# Altium project Bat_Detector_Full.PrjPcb
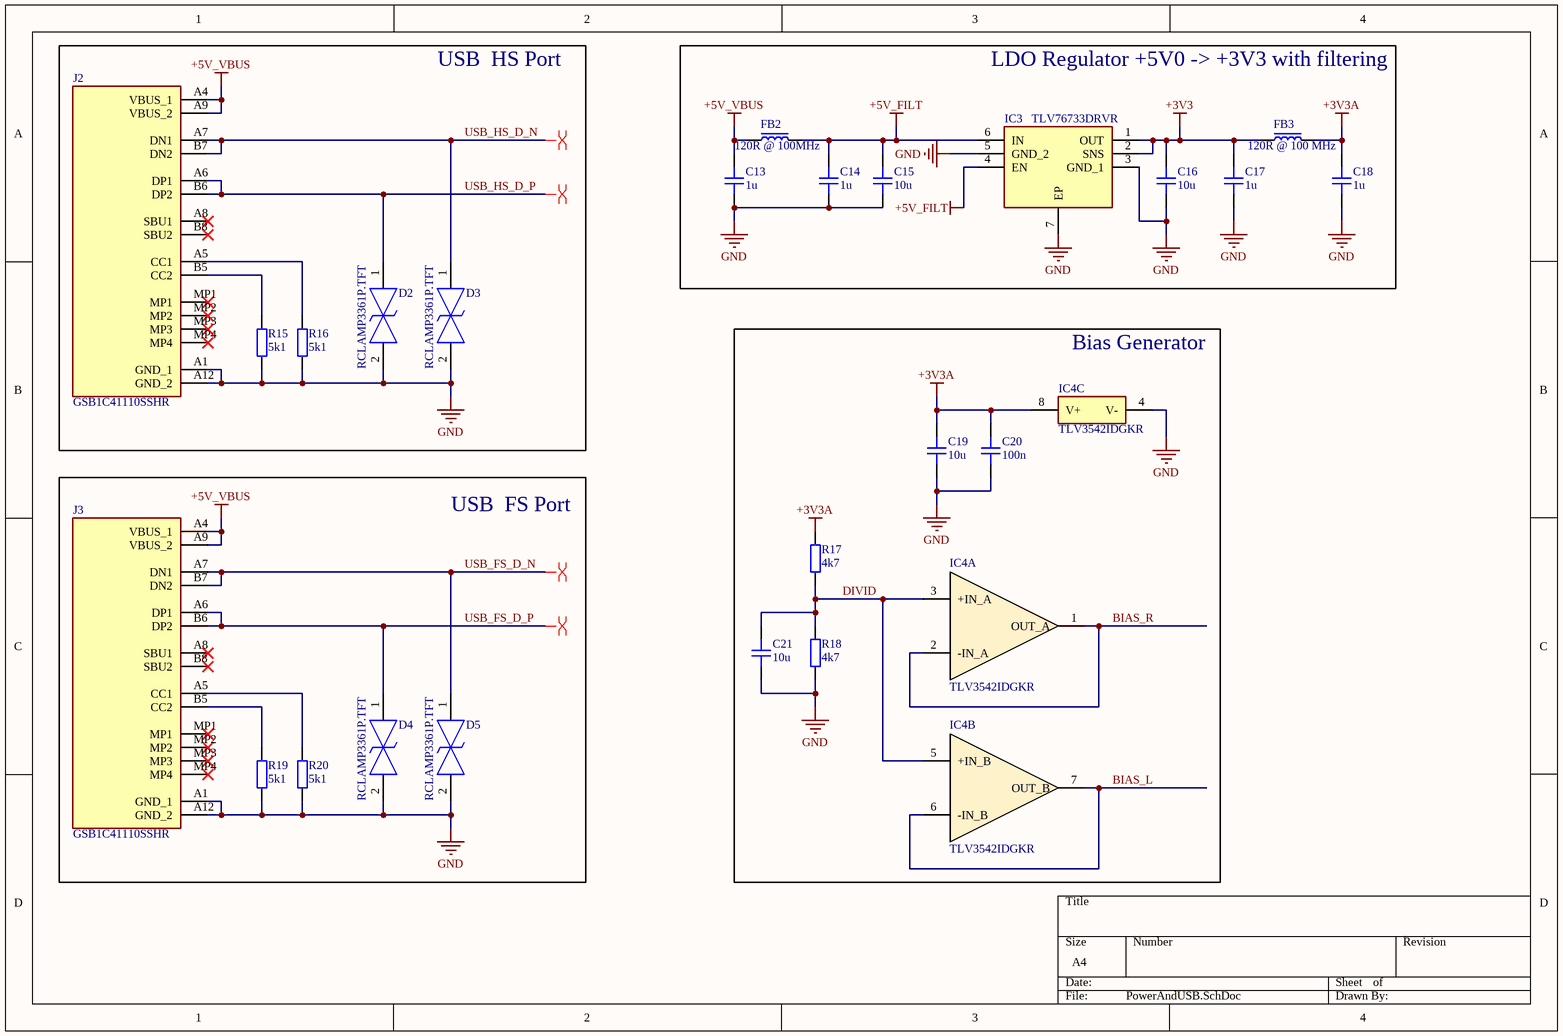
[diagram p0: PowerAndUSB.SchDoc]
4 sheets, 132 parts. Net scope: global (net labels, ports and power ports of the same name join across sheets).
Board file: PCBDesign.PcbDoc
Sheets:
  PowerAndUSB.SchDoc
  MCU.SchDoc
  AudioADC.SchDoc
  MEMSAndAnalogFrontend.SchDoc

## Sheet PowerAndUSB.SchDoc
size A4; SheetNumber: 1; SheetTotal: 4

### Parts
C13  1u  [CAP_0805]
C14  1u  [CAP_0805]
C15  10u  [CAP_0805]
C16  10u  [CAP_0805]
C17  1u  [CAP_0402]
C18  1u  [CAP_0402]
C19  10u  [CAP_0603]
C20  100n  [CAP_0402]
C21  10u  [CAP_0603]
D2  RCLAMP3361P.TFT  [RCLAMP3361PTFT]
D3  RCLAMP3361P.TFT  [RCLAMP3361PTFT]
D4  RCLAMP3361P.TFT  [RCLAMP3361PTFT]
D5  RCLAMP3361P.TFT  [RCLAMP3361PTFT]
FB2  120R @ 100MHz  [FB_0805]
FB3  120R @ 100 MHz  [FB_0603]
IC3  TLV76733DRVR  [SON65P200X200X80-7N]
IC4  TLV3542IDGKR  [SOP65P490X110-8N]  (parts A,B,C of 3)
J2  GSB1C41110SSHR  [GSB1C41110SSHR]
J3  GSB1C41110SSHR  [GSB1C41110SSHR]
R15  5k1  [RES_0402]
R16  5k1  [RES_0402]
R17  4k7  [RES_0603]
R18  4k7  [RES_0603]
R19  5k1  [RES_0402]
R20  5k1  [RES_0402]

### Blocks framed on the sheet
USB  HS Port: D2 D3 J2 R15 R16
LDO Regulator +5V0 -> +3V3 with filtering: C13-C18 FB2 FB3 IC3
Bias Generator: C19-C21 IC4 R17 R18
USB  FS Port: D4 D5 J3 R19 R20

### Nets
+3V3: C16.2 C17.1 FB3.1 IC3.1(OUT) IC3.2(SNS)
+3V3A: C18.1 C19.2 C20.2 FB3.2 IC4.8(V+) R17.2
+5V_FILT: C14.2 C15.2 FB2.2 IC3.4(EN) IC3.6(IN)
+5V_VBUS: C13.2 FB2.1 J2.A4(VBUS_1) J2.A9(VBUS_2) J3.A4(VBUS_1) J3.A9(VBUS_2)
GND: C13.1 C14.1 C15.1 C16.1 C17.2 C18.2 C19.1 C20.1 C21.1 D2.2 D3.2 D4.2 D5.2 IC3.3(GND_1) IC3.5(GND_2) IC3.7(EP) IC4.4(V-) J2.A1(GND_1) J2.A12(GND_2) J3.A1(GND_1) J3.A12(GND_2) R15.1 R16.1 R18.1 R19.1 R20.1
BIAS_L: IC4.6(-IN_B) IC4.7(OUT_B)
BIAS_R: IC4.1(OUT_A) IC4.2(-IN_A)
DIVID: C21.2 IC4.3(+IN_A) IC4.5(+IN_B) R17.1 R18.2
USB_FS_D_N: D5.1 J3.A7(DN1) J3.B7(DN2)
USB_FS_D_P: D4.1 J3.A6(DP1) J3.B6(DP2)
USB_HS_D_N: D3.1 J2.A7(DN1) J2.B7(DN2)
USB_HS_D_P: D2.1 J2.A6(DP1) J2.B6(DP2)
NetJ2_A5: J2.A5(CC1) R16.2
NetJ2_B5: J2.B5(CC2) R15.2
NetJ3_A5: J3.A5(CC1) R20.2
NetJ3_B5: J3.B5(CC2) R19.2

Not connected (* = marked no-connect by the designer): J2 A8(SBU1)* B8(SBU2)* MP1* MP2* MP3* MP4*; J3 A8(SBU1)* B8(SBU2)* MP1* MP2* MP3* MP4*

### Layout directives
differential pair: USB_FS_D_N, USB_FS_D_P, USB_HS_D_N, USB_HS_D_P

### Library data of the parts
C13-C16 = CAP_0805: Capacitor SMD 0805; Manufacturer: *; Manufacturer Part Number: *; Distributor Link: *; LCSC: *; Rating: *; Dielectric: *
C17 C18 C20 = CAP_0402: Capacitor SMD 0402; Manufacturer: *; Manufacturer Part Number: *; Distributor Link: *; LCSC: *; Rating: *; Dielectric: *
C19 C21 = CAP_0603: Capacitor SMD 0603; Manufacturer: *; Manufacturer Part Number: *; Distributor Link: *; LCSC: *; Rating: *; Dielectric: *
D2-D5 = RCLAMP3361P.TFT: TVS Diode (Bi-directional); Manufacturer_Name: SEMTECH; Datasheet Link: https://www.mouser.co.uk/datasheet/2/196/CYPR_S_A0000095755_1-3003525.pdf; Height: 0.53mm; Manufacturer_Part_Number: RCLAMP3361P.TFT
FB2 = FB_0805: Ferrite Bead SMD 0805; Manufacturer: *; Manufacturer Part Number: *; Distributor Link: *; LCSC: *
FB3 = FB_0603: Ferrite Bead SMD 0603; Manufacturer: *; Manufacturer Part Number: *; Distributor Link: *; LCSC: *
IC3 = TLV76733DRVR: Integrated Circuit; Manufacturer_Name: Texas Instruments; Datasheet Link: http://www.ti.com/lit/gpn/TLV767; Height: 0.8mm; Manufacturer_Part_Number: TLV76733DRVR; Mouser Part Number: 595-TLV76733DRVR; Mouser Price/Stock: https://www.mouser.co.uk/ProductDetail/Texas-Instruments/TLV76733DRVR?qs=9r4v7xj2LnmGIkwTuPlHig%3D%3D; Arrow Part Number: TLV76733DRVR; Arrow Price/Stock: https://www.arrow.com/en/products/tlv76733drvr/texas-instruments?region=nac
IC4 = TLV3542IDGKR: Integrated Circuit; Manufacturer_Name: Texas Instruments; Datasheet Link: http://www.ti.com/lit/gpn/tlv3542; Height: 1.1mm; Manufacturer_Part_Number: TLV3542IDGKR; Mouser Part Number: 595-TLV3542IDGKR; Mouser Price/Stock: https://www.mouser.co.uk/ProductDetail/Texas-Instruments/TLV3542IDGKR?qs=9lcNTSmDlCr5gl2sVJgJdw%3D%3D; Arrow Part Number: TLV3542IDGKR; Arrow Price/Stock: https://www.arrow.com/en/products/tlv3542idgkr/texas-instruments
J2 J3 = GSB1C41110SSHR: Connector; Manufacturer_Name: Amphenol Communications Solutions; Datasheet Link: https://cdn.amphenol-cs.com/media/wysiwyg/files/drawing/gsb1c41x10sshr-ax1.pdf; Height: 3.41mm; Manufacturer_Part_Number: GSB1C41110SSHR
R15 R16 R19 R20 = RES_0402: Resistor SMD 0402; Manufacturer: *; Manufacturer Part Number: *; Distributor Link: *; LCSC: *
R17 R18 = RES_0603: Resistor SMD 0603; Manufacturer: *; Manufacturer Part Number: *; Distributor Link: *; LCSC: *

## Sheet MCU.SchDoc
size A4; SheetNumber: 2; SheetTotal: 4
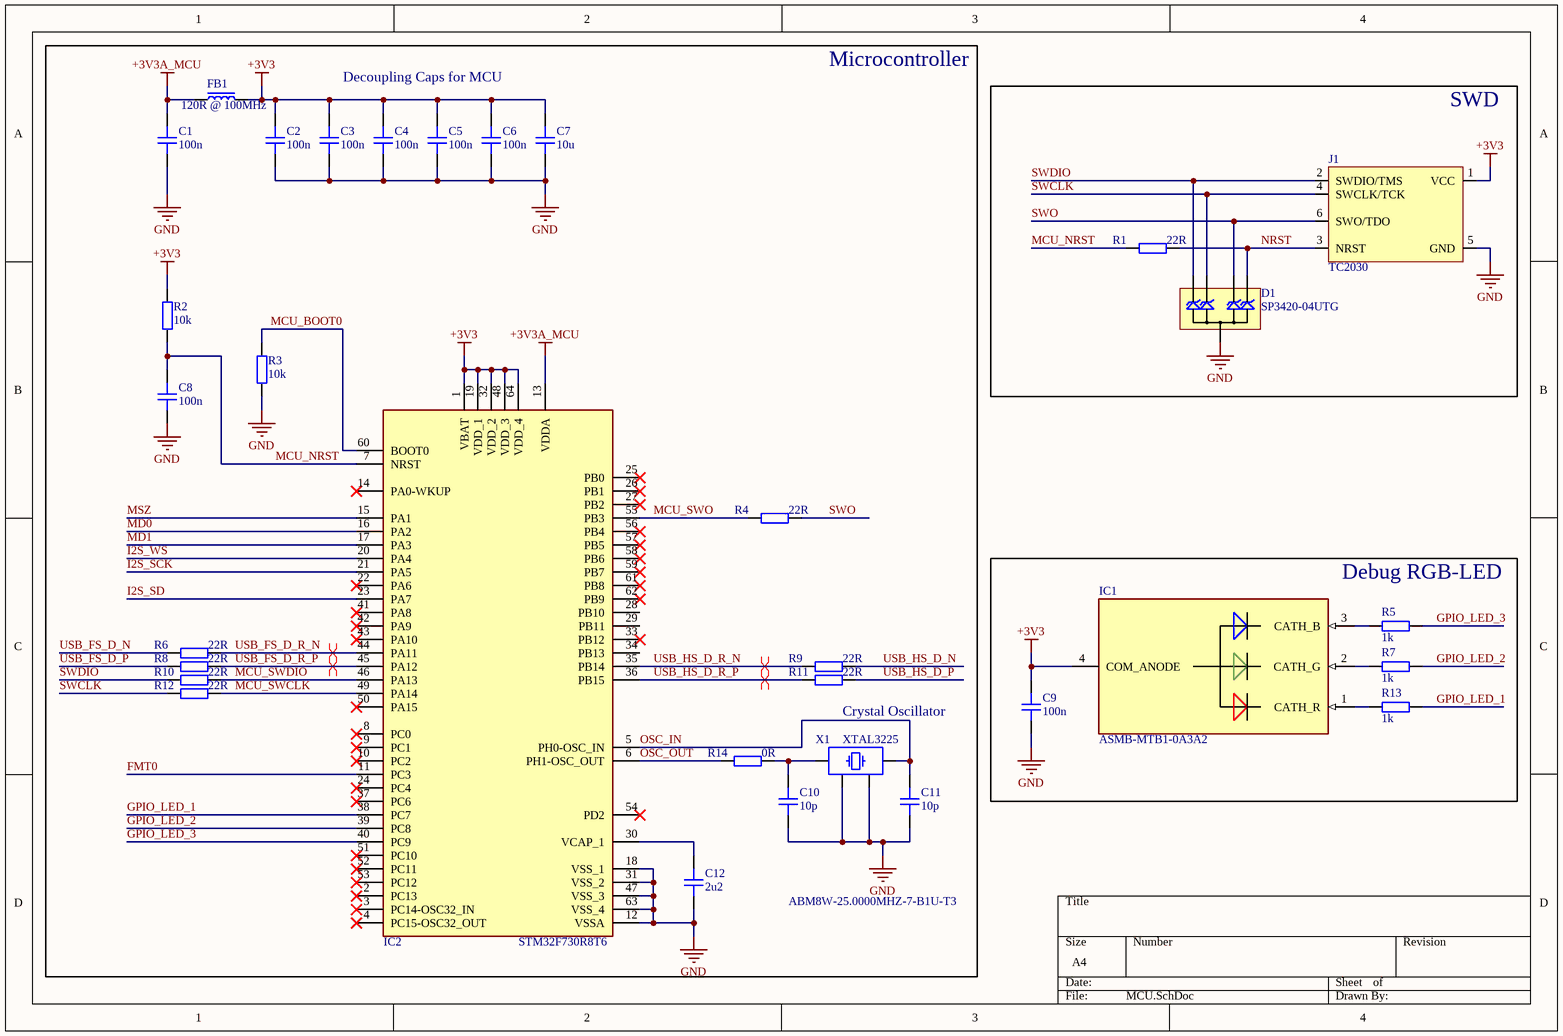
[diagram p1: MCU.SchDoc]

### Parts
C1  100n  [CAP_0402]
C2  100n  [CAP_0402]
C3  100n  [CAP_0402]
C4  100n  [CAP_0402]
C5  100n  [CAP_0402]
C6  100n  [CAP_0402]
C7  10u  [CAP_0603]
C8  100n  [CAP_0402]
C9  100n  [CAP_0402]
C10  10p  [CAP_0402]
C11  10p  [CAP_0402]
C12  2u2  [CAP_0402]
D1  SP3420-04UTG  [uDFN-10]
FB1  120R @ 100MHz  [FB_0402]
IC1  ASMB-MTB1-0A3A2  [AVAGO_PLCC4]
IC2  STM32F730R8T6  [QFP50P1200X1200X160-64N]
J1  TC2030  [TC2030-FP]  (no BOM)
R1  22R  [RES_0402]
R2  10k  [RES_0402]
R3  10k  [RES_0402]
R4  22R  [RES_0402]
R5  1k  [RES_0402]
R6  22R  [RES_0402]
R7  1k  [RES_0402]
R8  22R  [RES_0402]
R9  22R  [RES_0402]
R10  22R  [RES_0402]
R11  22R  [RES_0402]
R12  22R  [RES_0402]
R13  1k  [RES_0402]
R14  0R  [RES_0402]
X1  XTAL3225  [XTAL_3225]

### Blocks framed on the sheet
Microcontroller: C1-C8 C10-C12 FB1 IC2 R2-R4 R6 R8-R12 R14 X1
SWD: D1 J1 R1
Debug RGB-LED: C9 IC1 R5 R7 R13

### Nets
+3V3: C2.2 C3.2 C4.2 C5.2 C6.2 C7.2 C9.2 FB1.2 IC1.4(COM_ANODE) IC2.1(VBAT) IC2.19(VDD_1) IC2.32(VDD_2) IC2.48(VDD_3) IC2.64(VDD_4) J1.1(VCC) R2.1
+3V3A_MCU: C1.2 FB1.1 IC2.13(VDDA)
GND: C1.1 C2.1 C3.1 C4.1 C5.1 C6.1 C7.1 C8.1 C9.1 C10.1 C11.1 C12.1 D1.38(GND) IC2.12(VSSA) IC2.18(VSS_1) IC2.31(VSS_2) IC2.47(VSS_3) IC2.63(VSS_4) J1.5(GND) R3.1 X1.2 X1.4
FMT0: IC2.11(PC3)
GPIO_LED_1: IC2.38(PC7) R13.1
GPIO_LED_2: IC2.39(PC8) R7.1
GPIO_LED_3: IC2.40(PC9) R5.1
I2S_SCK: IC2.21(PA5)
I2S_SD: IC2.23(PA7)
I2S_WS: IC2.20(PA4)
MCU_BOOT0: IC2.60(BOOT0) R3.2
MCU_NRST: C8.2 IC2.7(NRST) R1.1 R2.2
MCU_SWCLK: IC2.49(PA14) R12.2
MCU_SWDIO: IC2.46(PA13) R10.2
MCU_SWO: IC2.55(PB3) R4.1
MD0: IC2.16(PA2)
MD1: IC2.17(PA3)
MSZ: IC2.15(PA1)
NRST: D1.56 J1.3(NRST) R1.2
OSC_IN: C11.2 IC2.5(PH0-OSC_IN) X1.1
OSC_OUT: IC2.6(PH1-OSC_OUT) R14.1
SWCLK: D1.29 J1.4(SWCLK/TCK) R12.1
SWDIO: D1.110 J1.2(SWDIO/TMS) R10.1
SWO: D1.47 J1.6(SWO/TDO) R4.2
USB_FS_D_N: R6.1
USB_FS_D_P: R8.1
USB_FS_D_R_N: IC2.44(PA11) R6.2
USB_FS_D_R_P: IC2.45(PA12) R8.2
USB_HS_D_N: R9.2
USB_HS_D_P: R11.2
USB_HS_D_R_N: IC2.35(PB14) R9.1
USB_HS_D_R_P: IC2.36(PB15) R11.1
NetC10_2: C10.2 R14.2 X1.3
NetC12_2: C12.2 IC2.30(VCAP_1)
NetIC1_1: IC1.1(CATH_R) R13.2
NetIC1_2: IC1.2(CATH_G) R7.2
NetIC1_3: IC1.3(CATH_B) R5.2

Not connected (* = marked no-connect by the designer): IC2 2(PC13)* 3(PC14-OSC32_IN)* 4(PC15-OSC32_OUT)* 8(PC0)* 9(PC1)* 10(PC2)* 14(PA0-WKUP)* 22(PA6)* 24(PC4)* 25(PB0)* 26(PB1)* 27(PB2)* 28(PB10) 29(PB11) 33(PB12)* 34(PB13) 37(PC6)* 41(PA8)* 42(PA9)* 43(PA10)* 50(PA15)* 51(PC10)* 52(PC11)* 53(PC12)* 54(PD2)* 56(PB4)* 57(PB5)* 58(PB6)* 59(PB7)* 61(PB8)* 62(PB9)*

### Layout directives
differential pair: USB_FS_D_R_N, USB_FS_D_R_P, USB_HS_D_R_N, USB_HS_D_R_P

### Notes on the sheet
- Decoupling Caps for MCU
- Crystal Oscillator
- ABM8W-25.0000MHZ-7-B1U-T3

### Library data of the parts
C1-C6 C8-C12 = CAP_0402: Capacitor SMD 0402; Manufacturer: *; Manufacturer Part Number: *; Distributor Link: *; LCSC: *; Rating: *; Dielectric: *
C7 = CAP_0603: Capacitor SMD 0603; Manufacturer: *; Manufacturer Part Number: *; Distributor Link: *; LCSC: *; Rating: *; Dielectric: *
D1 = SP3420-04UTG: TVS Diode Array Low Capacitance ESD Protection 4-Channel (Vwork=3V3, Vclamp=6V); Manufacturer: Littelfuse; Manufacturer Part Number: SP3420-04UTG
FB1 = FB_0402: Ferrite Bead SMD 0402; Manufacturer: *; Manufacturer Part Number: *; Distributor Link: *; LCSC: *
IC1 = ASMB-MTB1-0A3A2: Integrated Circuit; Manufacturer_Name: Avago Technologies; Datasheet Link: https://docs.broadcom.com/docs/AV02-4194EN; Manufacturer_Part_Number: ASMB-MTB1-0A3A2; Mouser Part Number: 630-ASMB-MTB1-0A3A2; Mouser Price/Stock: https://www.mouser.co.uk/ProductDetail/Broadcom-Avago/ASMB-MTB1-0A3A2?qs=ToP8pWlZ0bM7NIiOojjztA%3D%3D
IC2 = STM32F730R8T6: Integrated Circuit; Manufacturer_Name: STMicroelectronics; Datasheet Link: https://www.st.com/resource/en/datasheet/stm32f730r8.pdf; Height: 1.6mm; Manufacturer_Part_Number: STM32F730R8T6; Mouser Part Number: 511-STM32F730R8T6; Mouser Price/Stock: https://www.mouser.co.uk/ProductDetail/STMicroelectronics/STM32F730R8T6?qs=%252BEew9%252B0nqrB2Tb9O5sEwrw%3D%3D; Arrow Part Number: STM32F730R8T6; Arrow Price/Stock: https://www.arrow.com/en/products/stm32f730r8t6/stmicroelectronics?region=nac
J1 = TC2030: Tag-Connect No-Solder SWD Debug Connector DO NOT PLACE; Manufacturer: Tag-Connect; Manufacturer Part Number: TC2030
R1-R14 = RES_0402: Resistor SMD 0402; Manufacturer: *; Manufacturer Part Number: *; Distributor Link: *; LCSC: *
X1 = XTAL_3225: Crystal SMD 3225; Distributor Link: *

## Sheet AudioADC.SchDoc
size A4; SheetNumber: 3; SheetTotal: 4
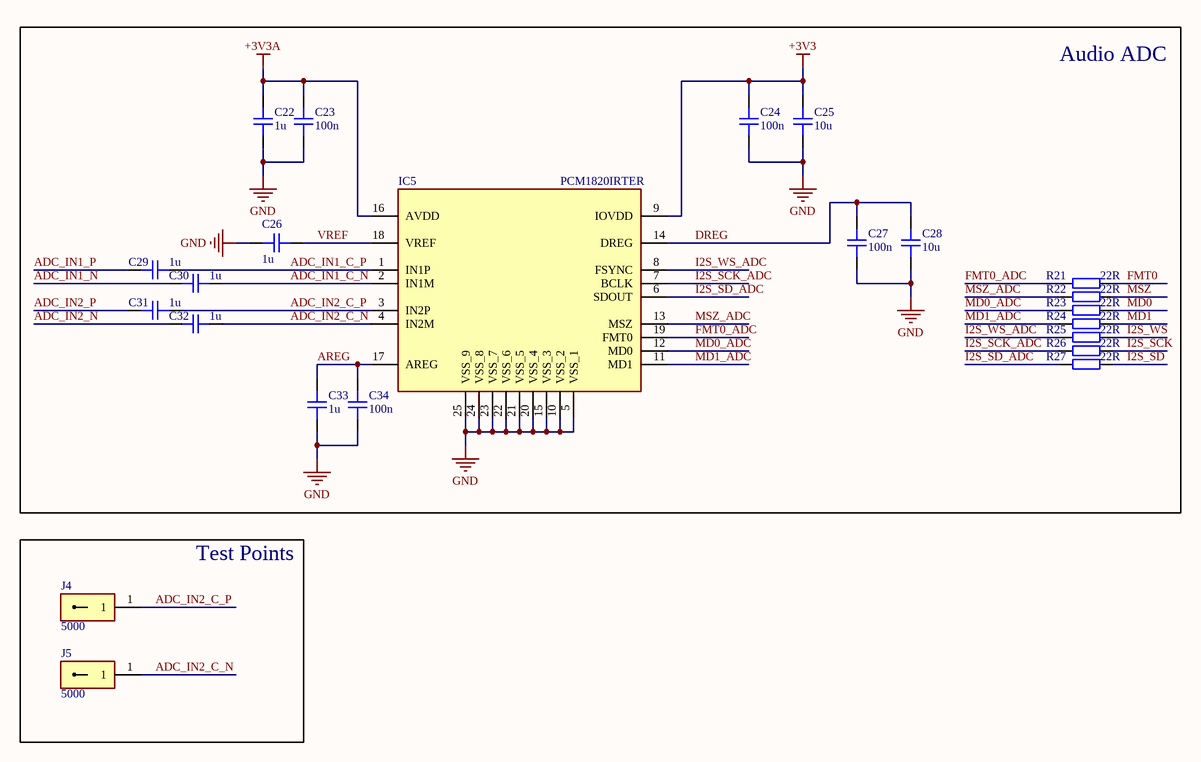
[diagram p2: AudioADC.SchDoc]

### Parts
C22  1u  [CAP_0603]
C23  100n  [CAP_0402]
C24  100n  [CAP_0402]
C25  10u  [CAP_0603]
C26  1u  [CAP_0402]
C27  100n  [CAP_0402]
C28  10u  [CAP_0603]
C29  1u  [CAP_0402]
C30  1u  [CAP_0402]
C31  1u  [CAP_0402]
C32  1u  [CAP_0402]
C33  1u  [CAP_0603]
C34  100n  [CAP_0402]
IC5  PCM1820IRTER  [PCM1820IRTER]
J4  5000  [5000]
J5  5000  [5000]
R21  22R  [RES_0402]
R22  22R  [RES_0402]
R23  22R  [RES_0402]
R24  22R  [RES_0402]
R25  22R  [RES_0402]
R26  22R  [RES_0402]
R27  22R  [RES_0402]

### Blocks framed on the sheet
Audio ADC: C22-C34 IC5 R21-R27
Test Points: J4 J5

### Nets
+3V3: C24.2 C25.2 IC5.9(IOVDD)
+3V3A: C22.2 C23.2 IC5.16(AVDD)
GND: C22.1 C23.1 C24.1 C25.1 C26.1 C27.1 C28.1 C33.1 C34.1 IC5.5(VSS_1) IC5.10(VSS_2) IC5.15(VSS_3) IC5.20(VSS_4) IC5.21(VSS_5) IC5.22(VSS_6) IC5.23(VSS_7) IC5.24(VSS_8) IC5.25(VSS_9)
ADC_IN1_C_N: C30.2 IC5.2(IN1M)
ADC_IN1_C_P: C29.2 IC5.1(IN1P)
ADC_IN1_N: C30.1
ADC_IN1_P: C29.1
ADC_IN2_C_N: C32.2 IC5.4(IN2M) J5.1
ADC_IN2_C_P: C31.2 IC5.3(IN2P) J4.1
ADC_IN2_N: C32.1
ADC_IN2_P: C31.1
AREG: C33.2 C34.2 IC5.17(AREG)
DREG: C27.2 C28.2 IC5.14(DREG)
FMT0: R21.2
FMT0_ADC: IC5.19(FMT0) R21.1
I2S_SCK: R26.2
I2S_SCK_ADC: IC5.7(BCLK) R26.1
I2S_SD: R27.2
I2S_SD_ADC: IC5.6(SDOUT) R27.1
I2S_WS: R25.2
I2S_WS_ADC: IC5.8(FSYNC) R25.1
MD0: R23.2
MD0_ADC: IC5.12(MD0) R23.1
MD1: R24.2
MD1_ADC: IC5.11(MD1) R24.1
MSZ: R22.2
MSZ_ADC: IC5.13(MSZ) R22.1
VREF: C26.2 IC5.18(VREF)

### Library data of the parts
C22 C25 C28 C33 = CAP_0603: Capacitor SMD 0603; Manufacturer: *; Manufacturer Part Number: *; Distributor Link: *; LCSC: *; Rating: *; Dielectric: *
C23 C24 C26 C27 C29-C32 C34 = CAP_0402: Capacitor SMD 0402; Manufacturer: *; Manufacturer Part Number: *; Distributor Link: *; LCSC: *; Rating: *; Dielectric: *
IC5 = PCM1820IRTER: Integrated Circuit; Manufacturer_Name: Texas Instruments; Datasheet Link: https://www.ti.com/lit/gpn/PCM1820; Height: 0.8mm; Manufacturer_Part_Number: PCM1820IRTER; Mouser Part Number: 595-PCM1820IRTER; Mouser Price/Stock: https://www.mouser.co.uk/ProductDetail/Texas-Instruments/PCM1820IRTER?qs=QNEnbhJQKvZFgZSjg2VzHg%3D%3D; Arrow Part Number: PCM1820IRTER; Arrow Price/Stock: https://www.arrow.com/en/products/pcm1820irter/texas-instruments?region=nac
J4 J5 = 5000: Connector; Manufacturer_Name: Keystone Electronics; Datasheet Link: http://www.keyelco.com/product-pdf.cfm?p=1309; Manufacturer_Part_Number: 5000; Mouser Part Number: 534-5000; Mouser Price/Stock: https://www.mouser.co.uk/ProductDetail/Keystone-Electronics/5000?qs=q0tsjPZWdm%252B9SiiTAbEwUw%3D%3D; Arrow Part Number: 5000; Arrow Price/Stock: https://www.arrow.com/en/products/5000/keystone-electronics?region=europe
R21-R27 = RES_0402: Resistor SMD 0402; Manufacturer: *; Manufacturer Part Number: *; Distributor Link: *; LCSC: *

## Sheet MEMSAndAnalogFrontend.SchDoc
size A3; SheetNumber: 4; SheetTotal: 4
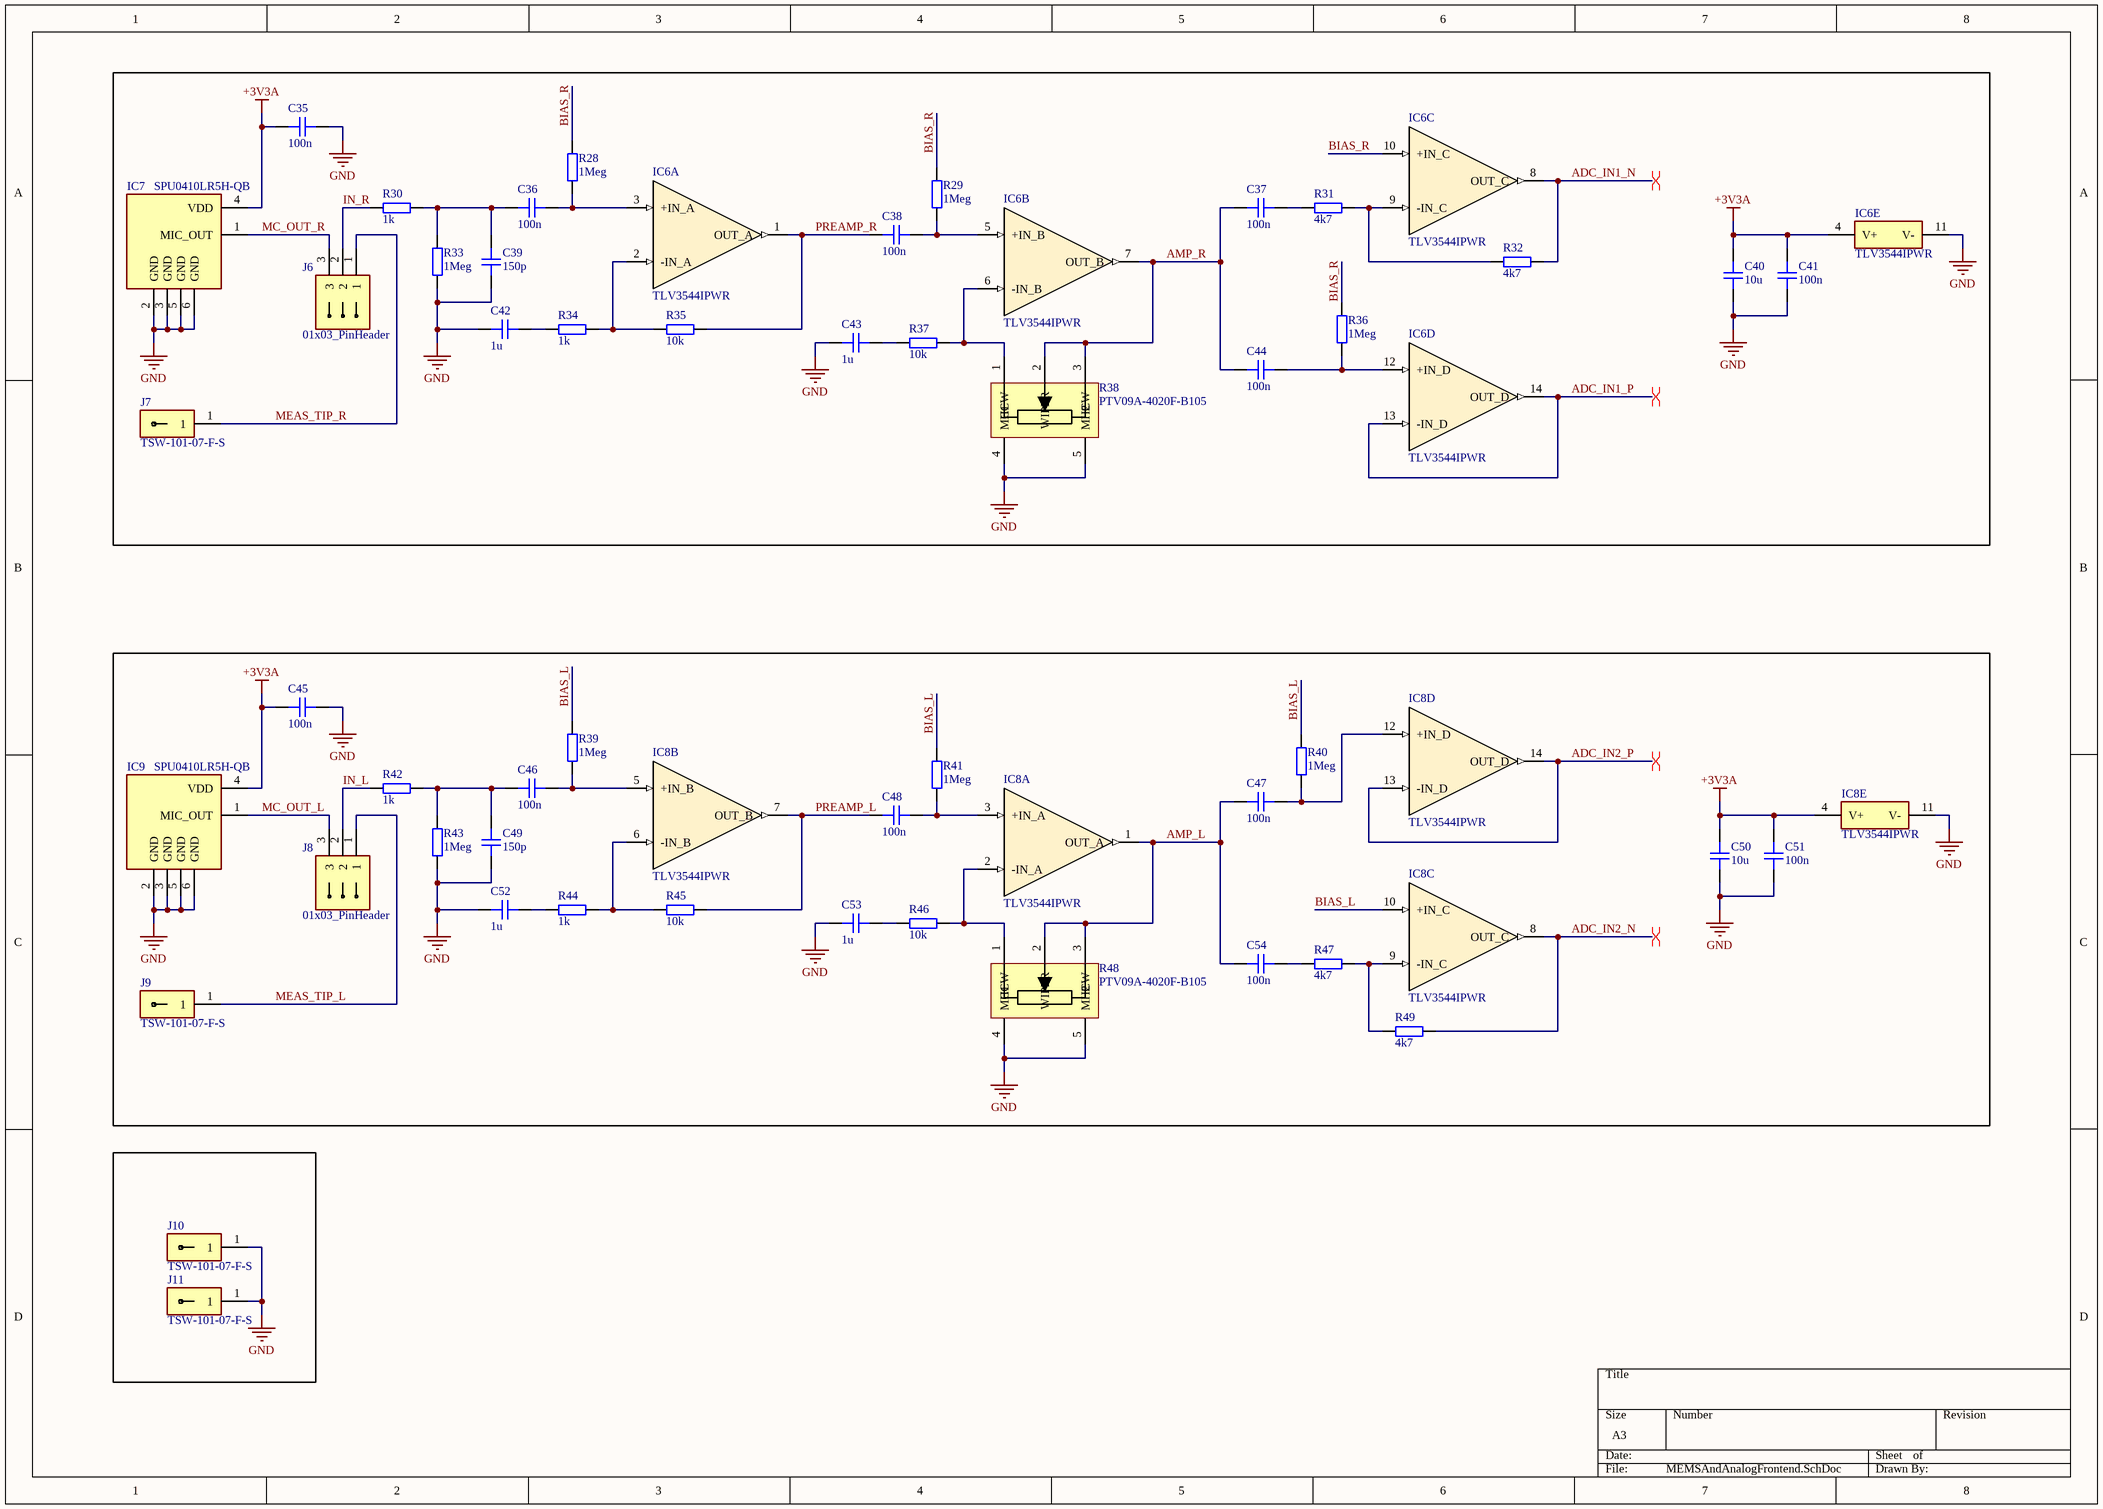
[diagram p3: MEMSAndAnalogFrontend.SchDoc]

### Parts
C35  100n  [CAP_0402]
C36  100n  [CAP_0402]
C37  100n  [CAP_0402]
C38  100n  [CAP_0402]
C39  150p  [CAP_0402]
C40  10u  [CAP_0603]
C41  100n  [CAP_0402]
C42  1u  [CAP_0402]
C43  1u  [CAP_0402]
C44  100n  [CAP_0402]
C45  100n  [CAP_0402]
C46  100n  [CAP_0402]
C47  100n  [CAP_0402]
C48  100n  [CAP_0402]
C49  150p  [CAP_0402]
C50  10u  [CAP_0603]
C51  100n  [CAP_0402]
C52  1u  [CAP_0402]
C53  1u  [CAP_0402]
C54  100n  [CAP_0402]
IC6  TLV3544IPWR  [SOP65P640X120-14N]  (parts A,B,C,D,E of 5)
IC7  SPU0410LR5H-QB  [SPU0410LR5H-QB]
IC8  TLV3544IPWR  [SOP65P640X120-14N]  (parts A,B,C,D,E of 5)
IC9  SPU0410LR5H-QB  [SPU0410LR5H-QB]
J6  01x03_PinHeader  [HDRV3W64P0X254_1X3_732X244X854P]
J7  TSW-101-07-F-S  [TSW-101-XX-YY-S]
J8  01x03_PinHeader  [HDRV3W64P0X254_1X3_732X244X854P]
J9  TSW-101-07-F-S  [TSW-101-XX-YY-S]
J10  TSW-101-07-F-S  [TSW-101-XX-YY-S]
J11  TSW-101-07-F-S  [TSW-101-XX-YY-S]
R28  1Meg  [RES_0402]
R29  1Meg  [RES_0402]
R30  1k  [RES_0402]
R31  4k7  [RES_0402]
R32  4k7  [RES_0402]
R33  1Meg  [RES_0402]
R34  1k  [RES_0402]
R35  10k  [RES_0402]
R36  1Meg  [RES_0402]
R37  10k  [RES_0402]
R38  PTV09A-4020F-B105  [PTV09A4020FB103]
R39  1Meg  [RES_0402]
R40  1Meg  [RES_0402]
R41  1Meg  [RES_0402]
R42  1k  [RES_0402]
R43  1Meg  [RES_0402]
R44  1k  [RES_0402]
R45  10k  [RES_0402]
R46  10k  [RES_0402]
R47  4k7  [RES_0402]
R48  PTV09A-4020F-B105  [PTV09A4020FB103]
R49  4k7  [RES_0402]

### Nets
+3V3A: C35.1 C40.2 C41.2 C45.1 C50.2 C51.2 IC6.4(V+) IC7.4(VDD) IC8.4(V+) IC9.4(VDD)
GND: C35.2 C39.2 C40.1 C41.1 C42.1 C43.1 C45.2 C49.2 C50.1 C51.1 C52.1 C53.1 IC6.11(V-) IC7.2(GND) IC7.3(GND) IC7.5(GND) IC7.6(GND) IC8.11(V-) IC9.2(GND) IC9.3(GND) IC9.5(GND) IC9.6(GND) J10.1 J11.1 R33.1 R38.4(MH1) R38.5(MH2) R43.1 R48.4(MH1) R48.5(MH2)
ADC_IN1_N: IC6.8(OUT_C) R32.2
ADC_IN1_P: IC6.13(-IN_D) IC6.14(OUT_D)
ADC_IN2_N: IC8.8(OUT_C) R49.2
ADC_IN2_P: IC8.13(-IN_D) IC8.14(OUT_D)
AMP_L: C47.2 C54.2 IC8.1(OUT_A) R48.2(WIPER) R48.3(CW)
AMP_R: C37.2 C44.2 IC6.7(OUT_B) R38.2(WIPER) R38.3(CW)
BIAS_L: IC8.10(+IN_C) R39.2 R40.2 R41.2
BIAS_R: IC6.10(+IN_C) R28.2 R29.2 R36.2
IN_L: J8.2 R42.1
IN_R: J6.2 R30.1
MC_OUT_L: IC9.1(MIC_OUT) J8.3
MC_OUT_R: IC7.1(MIC_OUT) J6.3
MEAS_TIP_L: J8.1 J9.1
MEAS_TIP_R: J6.1 J7.1
PREAMP_L: C48.2 IC8.7(OUT_B) R45.2
PREAMP_R: C38.2 IC6.1(OUT_A) R35.2
NetC36_1: C36.1 IC6.3(+IN_A) R28.1
NetC36_2: C36.2 C39.1 R30.2 R33.2
NetC37_1: C37.1 R31.1
NetC38_1: C38.1 IC6.5(+IN_B) R29.1
NetC42_2: C42.2 R34.1
NetC43_2: C43.2 R37.1
NetC44_1: C44.1 IC6.12(+IN_D) R36.1
NetC46_1: C46.1 IC8.5(+IN_B) R39.1
NetC46_2: C46.2 C49.1 R42.2 R43.2
NetC47_1: C47.1 IC8.12(+IN_D) R40.1
NetC48_1: C48.1 IC8.3(+IN_A) R41.1
NetC52_2: C52.2 R44.1
NetC53_2: C53.2 R46.1
NetC54_1: C54.1 R47.1
NetIC6_2: IC6.2(-IN_A) R34.2 R35.1
NetIC6_6: IC6.6(-IN_B) R37.2 R38.1(CCW)
NetIC6_9: IC6.9(-IN_C) R31.2 R32.1
NetIC8_2: IC8.2(-IN_A) R46.2 R48.1(CCW)
NetIC8_6: IC8.6(-IN_B) R44.2 R45.1
NetIC8_9: IC8.9(-IN_C) R47.2 R49.1

### Layout directives
differential pair: ADC_IN1_N, ADC_IN1_P, ADC_IN2_N, ADC_IN2_P

### Library data of the parts
C35-C39 C41-C49 C51-C54 = CAP_0402: Capacitor SMD 0402; Manufacturer: *; Manufacturer Part Number: *; Distributor Link: *; LCSC: *; Rating: *; Dielectric: *
C40 C50 = CAP_0603: Capacitor SMD 0603; Manufacturer: *; Manufacturer Part Number: *; Distributor Link: *; LCSC: *; Rating: *; Dielectric: *
IC6 IC8 = TLV3544IPWR: Integrated Circuit; Manufacturer_Name: Texas Instruments; Datasheet Link: http://www.ti.com/lit/gpn/tlv3544; Height: 1.2mm; Manufacturer_Part_Number: TLV3544IPWR; Mouser Part Number: 595-TLV3544IPWR; Mouser Price/Stock: https://www.mouser.co.uk/ProductDetail/Texas-Instruments/TLV3544IPWR?qs=9lcNTSmDlCo%2FGPDLoAm6Jw%3D%3D; Arrow Part Number: TLV3544IPWR; Arrow Price/Stock: https://www.arrow.com/en/products/tlv3544ipwr/texas-instruments
IC7 IC9 = SPU0410LR5H-QB: Knowles - MEMS Microphones MIC MEMS ANALOG OMNI -38DB
J6 J8 = 01x03_PinHeader: Connector; Manufacturer_Name: Hirose; Manufacturer_Part_Number: A2-3PA-2.54DSA(71); Datasheet Link: https://datasheet.lcsc.com/szlcsc/Hirose-HRS-A2-3PA-2-54DSA-71_C325000.pdf; Height: 8.54mm; Mouser Part Number: 798-A23PA254DSA71; Mouser Price/Stock: https://www.mouser.co.uk/ProductDetail/Hirose-Connector/A2-3PA-2.54DSA71?qs=eDUdFcBPps3wMwa6hYzhLw%3D%3D; Arrow Part Number: A2-3PA-2.54DSA(71); Arrow Price/Stock: https://www.arrow.com/en/products/a2-3pa-2.54dsa-71/hirose-electric
J7 J9-J11 = TSW-101-07-F-S: Connector; Manufacturer_Name: SAMTEC; Datasheet Link: http://suddendocs.samtec.com/prints/tsw-xxx-xx-xxx-x-xx-xxx-mkt.pdf; Manufacturer_Part_Number: TSW-101-07-F-S; Mouser Part Number: 200-TSW10107FS; Mouser Price/Stock: https://www.mouser.co.uk/ProductDetail/Samtec/TSW-101-07-F-S?qs=rU5fayqh%252BE1FyeYHuHva5w%3D%3D; Arrow Part Number: TSW-101-07-F-S; Arrow Price/Stock: https://www.arrow.com/en/products/tsw-101-07-f-s/samtec?region=nac
R28-R37 R39-R47 R49 = RES_0402: Resistor SMD 0402; Manufacturer: *; Manufacturer Part Number: *; Distributor Link: *; LCSC: *
R38 R48 = PTV09A-4020F-B105: Variable Resistor; Manufacturer_Name: Bourns; Datasheet Link: https://www.bourns.com/docs/Product-Datasheets/ptv09.pdf; Height: 20mm; Manufacturer_Part_Number: PTV09A-4020F-B105; Mouser Part Number: 652-PTV09A4020FB105; Mouser Price/Stock: https://www.mouser.co.uk/ProductDetail/Bourns/PTV09A-4020F-B105?qs=%252B9%2Fcbd0IE0TagBKq%252BGRbqw%3D%3D; Arrow Part Number: PTV09A-4020F-B105; Arrow Price/Stock: https://www.arrow.com/en/products/ptv09a-4020f-b105/bourns?region=nac

## Nets that join several sheets
+3V3: PowerAndUSB (5 pins), MCU (16 pins), AudioADC (C24.2 C25.2 IC5.9)
+3V3A: PowerAndUSB (6 pins), AudioADC (C22.2 C23.2 IC5.16), MEMSAndAnalogFrontend (10 pins)
GND: PowerAndUSB (26 pins), MCU (22 pins), AudioADC (18 pins), MEMSAndAnalogFrontend (30 pins)
ADC_IN1_N: AudioADC (C30.1), MEMSAndAnalogFrontend (IC6.8 R32.2)
ADC_IN1_P: AudioADC (C29.1), MEMSAndAnalogFrontend (IC6.13 IC6.14)
ADC_IN2_N: AudioADC (C32.1), MEMSAndAnalogFrontend (IC8.8 R49.2)
ADC_IN2_P: AudioADC (C31.1), MEMSAndAnalogFrontend (IC8.13 IC8.14)
BIAS_L: PowerAndUSB (IC4.6 IC4.7), MEMSAndAnalogFrontend (IC8.10 R39.2 R40.2 R41.2)
BIAS_R: PowerAndUSB (IC4.1 IC4.2), MEMSAndAnalogFrontend (IC6.10 R28.2 R29.2 R36.2)
FMT0: MCU (IC2.11), AudioADC (R21.2)
I2S_SCK: MCU (IC2.21), AudioADC (R26.2)
I2S_SD: MCU (IC2.23), AudioADC (R27.2)
I2S_WS: MCU (IC2.20), AudioADC (R25.2)
MD0: MCU (IC2.16), AudioADC (R23.2)
MD1: MCU (IC2.17), AudioADC (R24.2)
MSZ: MCU (IC2.15), AudioADC (R22.2)
USB_FS_D_N: PowerAndUSB (D5.1 J3.A7 J3.B7), MCU (R6.1)
USB_FS_D_P: PowerAndUSB (D4.1 J3.A6 J3.B6), MCU (R8.1)
USB_HS_D_N: PowerAndUSB (D3.1 J2.A7 J2.B7), MCU (R9.2)
USB_HS_D_P: PowerAndUSB (D2.1 J2.A6 J2.B6), MCU (R11.2)